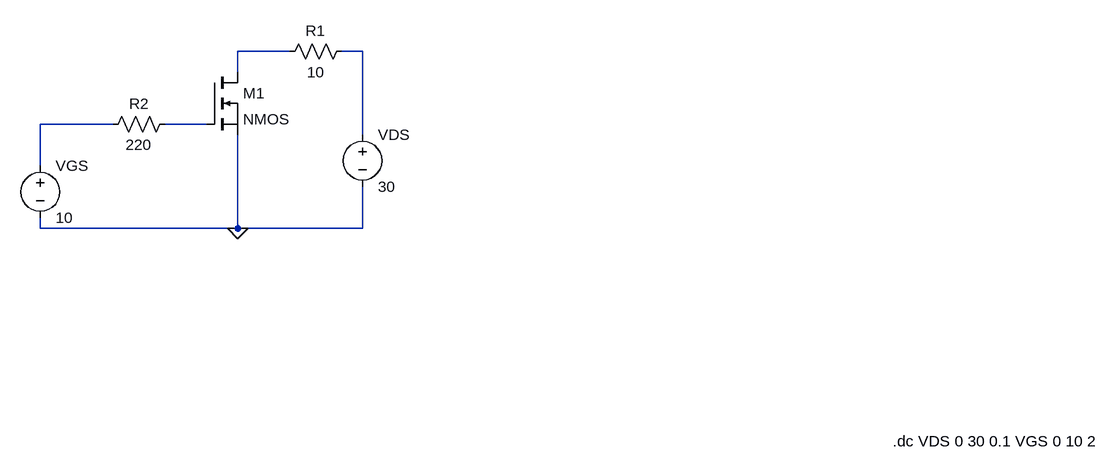
[diagram p0: schematic MOSFET.asc]
MOSFET.asc, the LTspice schematic file:
Version 4
SHEET 1 1480 680
WIRE 224 64 144 64
WIRE 336 64 304 64
WIRE 144 96 144 64
WIRE -48 176 -160 176
WIRE 96 176 32 176
WIRE 336 192 336 64
WIRE -160 240 -160 176
WIRE -160 336 -160 320
WIRE 144 336 144 192
WIRE 144 336 -160 336
WIRE 336 336 336 272
WIRE 336 336 144 336
FLAG 144 336 0
SYMBOL nmos 96 96 R0
SYMATTR InstName M1
SYMBOL res 320 48 R90
WINDOW 0 0 56 VBottom 2
WINDOW 3 32 56 VTop 2
SYMATTR InstName R1
SYMATTR Value 10
SYMBOL res 48 160 R90
WINDOW 0 0 56 VBottom 2
WINDOW 3 32 56 VTop 2
SYMATTR InstName R2
SYMATTR Value 220
SYMBOL voltage -160 224 R0
SYMATTR InstName VGS
SYMATTR Value 10
SYMBOL voltage 336 176 R0
SYMATTR InstName VDS
SYMATTR Value 30
TEXT 1152 664 Left 2 !.dc VDS 0 30 0.1 VGS 0 10 2

The netlist it stands for:
* MOSFET.asc
M1 N001 N004 0 0 NMOS
R1 N002 N001 10
R2 N004 N003 220
VGS N003 0 10
VDS N002 0 30
.model NMOS NMOS
.model PMOS PMOS
.lib standard.mos
.dc VDS 0 30 0.1 VGS 0 10 2
.backanno
.end